# Altium schematic sheet Control.SchDoc
size 420 x 297 mm; DocumentNumber: Control, Wolf-2; SheetNumber: 6; SheetTotal: 6
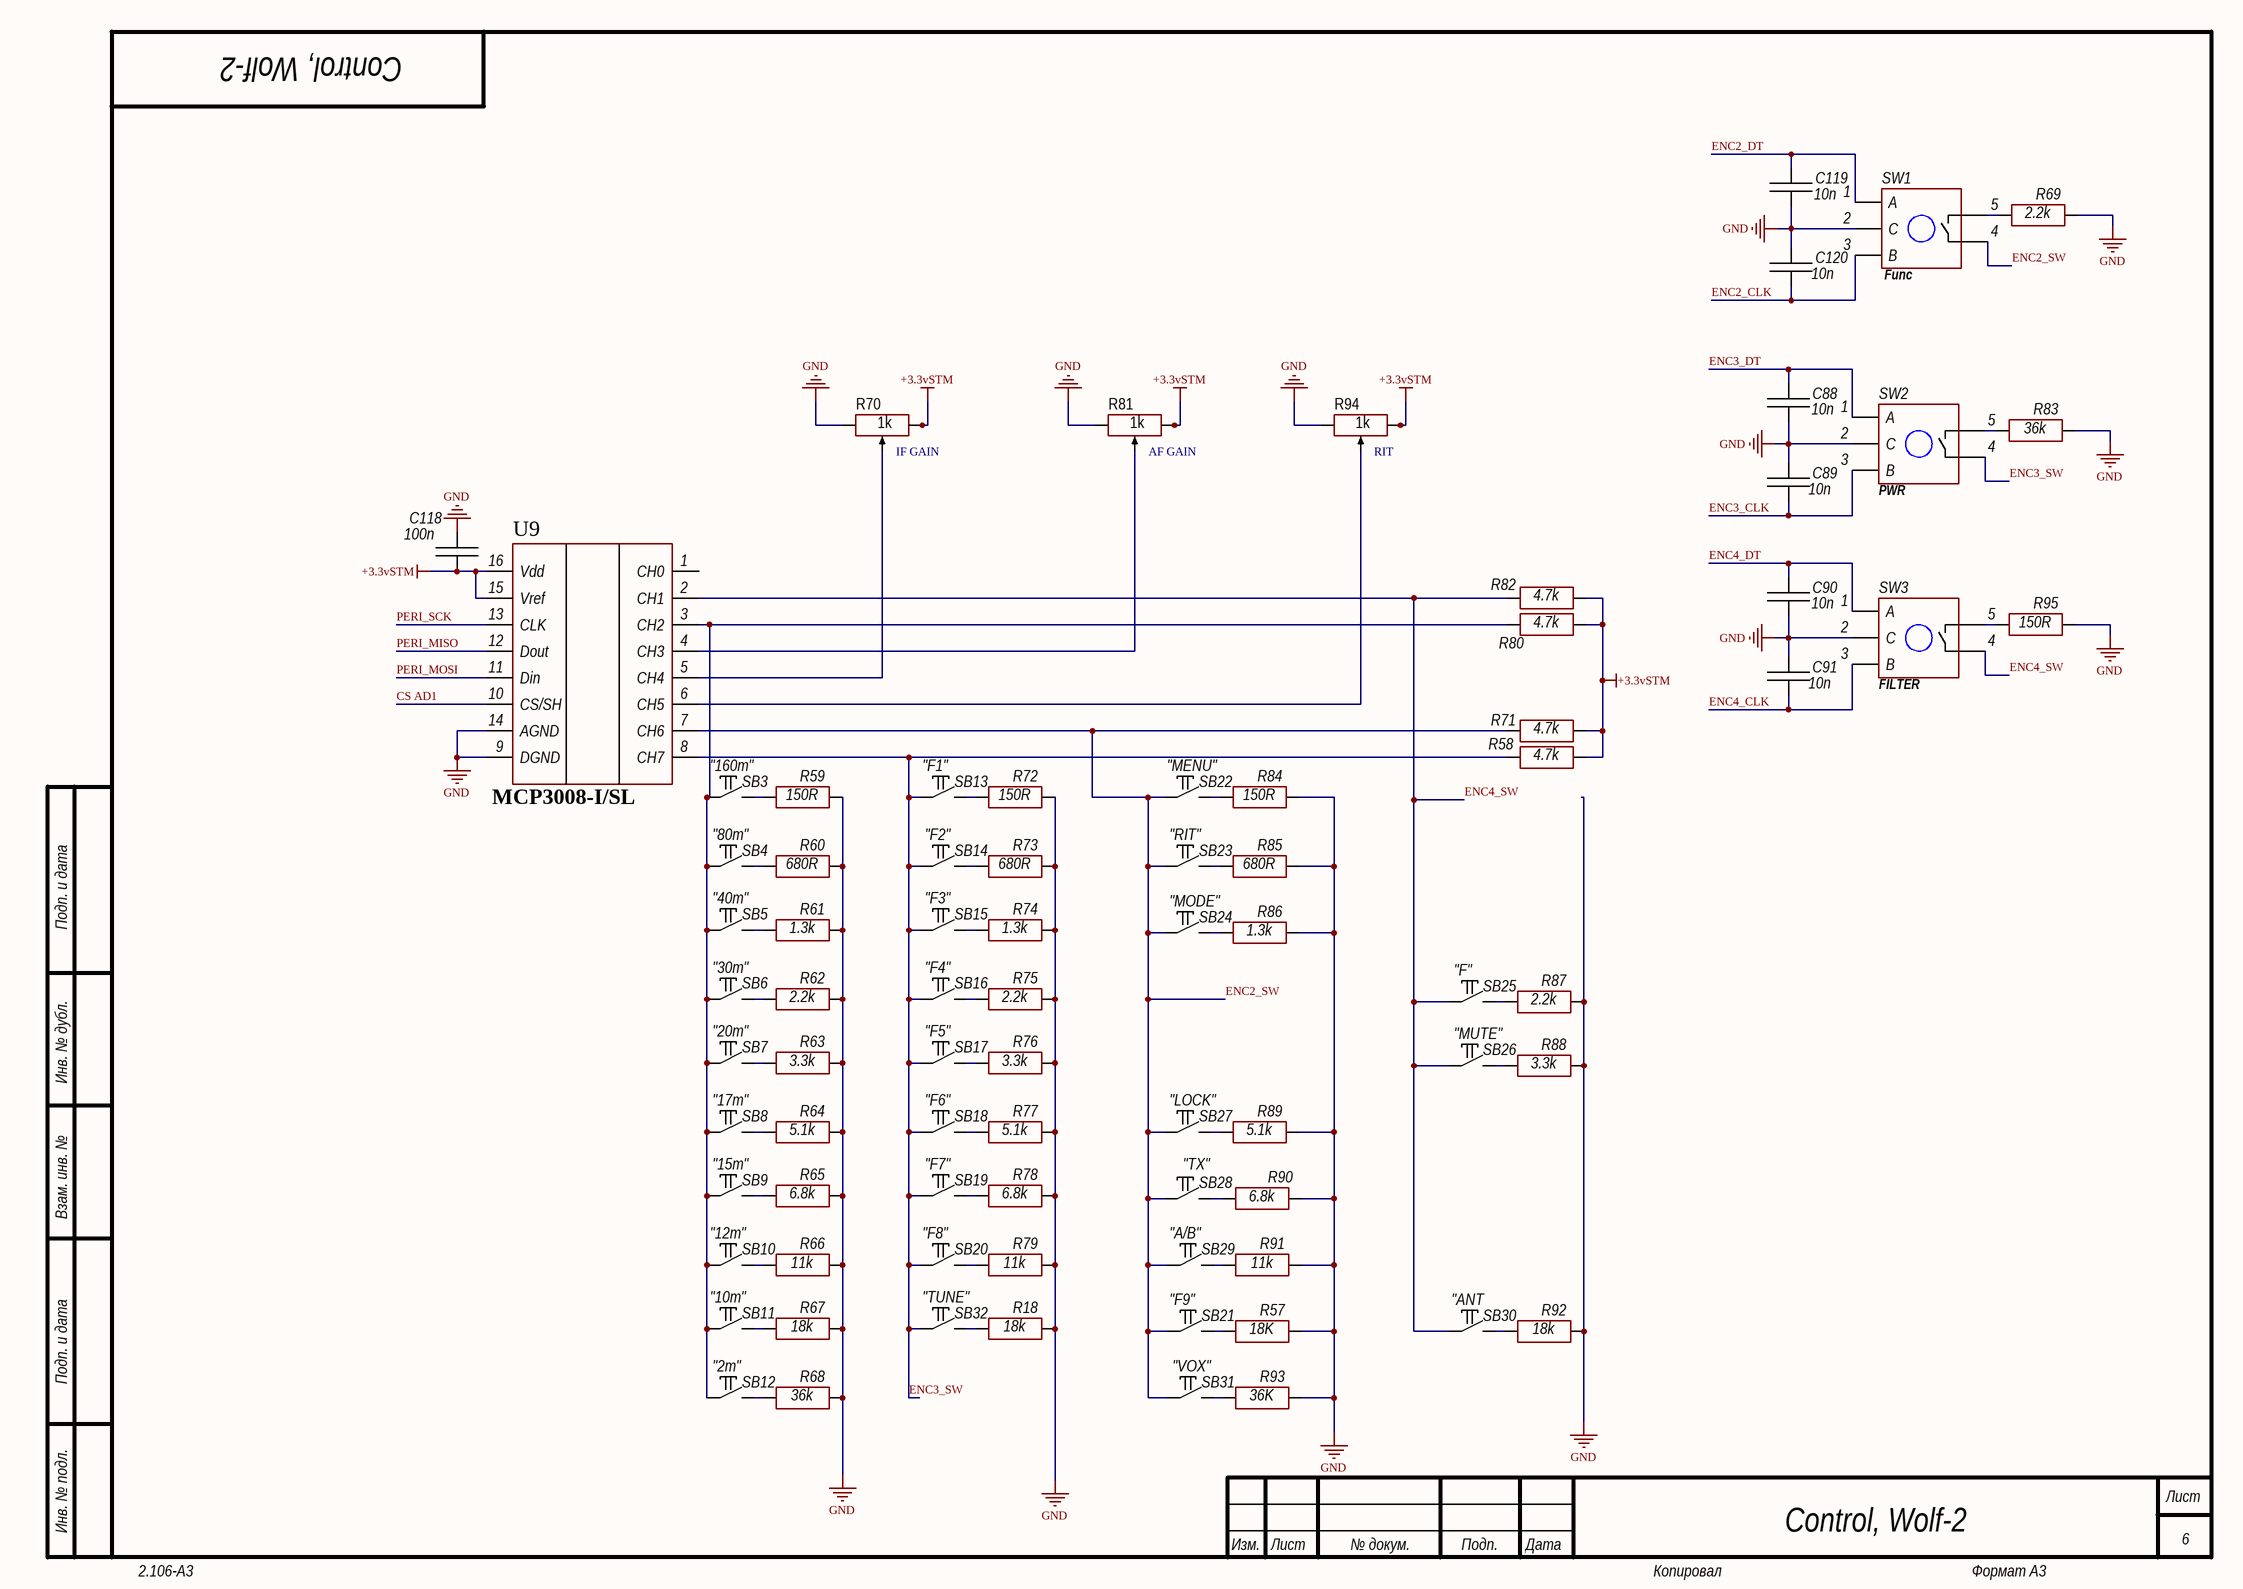
[diagram p0: Control.SchDoc]

## Parts
C88  10n  [CH0805C]
C89  10n  [CH0805C]
C90  10n  [CH0805C]
C91  10n  [CH0805C]
C118  100n  [CH0805C]
C119  10n  [CH0805C]
C120  10n  [CH0805C]
R18  18k  [CH0805R]
R57  18K  [CH0805R]
R58  4.7k  [CH0805R]
R59  150R  [CH0805R]
R60  680R  [CH0805R]
R61  1.3k  [CH0805R]
R62  2.2k  [CH0805R]
R63  3.3k  [CH0805R]
R64  5.1k  [CH0805R]
R65  6.8k  [CH0805R]
R66  11k  [CH0805R]
R67  18k  [CH0805R]
R68  36k  [CH0805R]
R69  2.2k  [CH0805R]
R70  1k  [PTV09]
R71  4.7k  [CH0805R]
R72  150R  [CH0805R]
R73  680R  [CH0805R]
R74  1.3k  [CH0805R]
R75  2.2k  [CH0805R]
R76  3.3k  [CH0805R]
R77  5.1k  [CH0805R]
R78  6.8k  [CH0805R]
R79  11k  [CH0805R]
R80  4.7k  [CH0805R]
R81  1k  [PTV09]
R82  4.7k  [CH0805R]
R83  36k  [CH0805R]
R84  150R  [CH0805R]
R85  680R  [CH0805R]
R86  1.3k  [CH0805R]
R87  2.2k  [CH0805R]
R88  3.3k  [CH0805R]
R89  5.1k  [CH0805R]
R90  6.8k  [CH0805R]
R91  11k  [CH0805R]
R92  18k  [CH0805R]
R93  36K  [CH0805R]
R94  1k  [PTV09]
R95  150R  [CH0805R]
SB3  "160m"  [BUT: 6x6]
SB4  "80m"  [BUT: 6x6]
SB5  "40m"  [BUT: 6x6]
SB6  "30m"  [BUT: 6x6]
SB7  "20m"  [BUT: 6x6]
SB8  "17m"  [BUT: 6x6]
SB9  "15m"  [BUT: 6x6]
SB10  "12m"  [BUT: 6x6]
SB11  "10m"  [BUT: 6x6]
SB12  "2m"  [BUT: 6x6]
SB13  "F1"  [BUT: 6x6]
SB14  "F2"  [BUT: 6x6]
SB15  "F3"  [BUT: 6x6]
SB16  "F4"  [BUT: 6x6]
SB17  "F5"  [BUT: 6x6]
SB18  "F6"  [BUT: 6x6]
SB19  "F7"  [BUT: 6x6]
SB20  "F8"  [BUT: 6x6]
SB21  "F9"  [BUT: 6x6]
SB22  "MENU"  [BUT: 6x6]
SB23  "RIT"  [BUT: 6x6]
SB24  "MODE"  [BUT: 6x6]
SB25  "F"  [BUT: 6x6]
SB26  "MUTE"  [BUT: 6x6]
SB27  "LOCK"  [BUT: 6x6]
SB28  "TX"  [BUT: 6x6]
SB29  "A/B"  [BUT: 6x6]
SB30  "ANT  [BUT: 6x6]
SB31  "VOX"  [BUT: 6x6]
SB32  "TUNE"  [BUT: 6x6]
SW1  Func  [ENC: PEC-12]
SW2  PWR  [ENC: PEC-12]
SW3  FILTER  [ENC: PEC-12]
U9  MCP3008-I/SL  [16-SOIC]

## Nets
+3.3vSTM: C118.1 R58.2 R70.1 R71.2 R80.2 R81.1 R82.2 R94.1 U9.15(Vref) U9.16(Vdd)
GND: C88.1 C89.2 C90.1 C91.2 C118.2 C119.1 C120.2 R18.2 R57.2 R59.2 R60.2 R61.2 R62.2 R63.2 R64.2 R65.2 R66.2 R67.2 R68.2 R69.2 R70.3 R72.2 R73.2 R74.2 R75.2 R76.2 R77.2 R78.2 R79.2 R81.3 R83.2 R84.2 R85.2 R86.2 R87.2 R88.2 R89.2 R90.2 R91.2 R92.2 R93.2 R94.3 R95.2 SW1.2(C) SW2.2(C) SW3.2(C) U9.9(DGND) U9.14(AGND)
CS AD1: U9.10(CS/SH)
ENC2_CLK: C120.1 SW1.3(B)
ENC2_DT: C119.2 SW1.1(A)
ENC2_SW: R71.1 SB21.1 SB22.1 SB23.1 SB24.1 SB27.1 SB28.1 SB29.1 SB31.1 SW1.4 U9.7(CH6)
ENC3_CLK: C89.1 SW2.3(B)
ENC3_DT: C88.2 SW2.1(A)
ENC3_SW: R58.1 SB13.1 SB14.1 SB15.1 SB16.1 SB17.1 SB18.1 SB19.1 SB20.1 SB32.1 SW2.4 U9.8(CH7)
ENC4_CLK: C91.1 SW3.3(B)
ENC4_DT: C90.2 SW3.1(A)
ENC4_SW: R82.1 SB25.1 SB26.1 SB30.1 SW3.4 U9.2(CH1)
PERI_MISO: U9.12(Dout)
PERI_MOSI: U9.11(Din)
PERI_SCK: U9.13(CLK)
NetR18_1: R18.1 SB32.2
NetR57_1: R57.1 SB21.2
NetR59_1: R59.1 SB3.2
NetR60_1: R60.1 SB4.2
NetR61_1: R61.1 SB5.2
NetR62_1: R62.1 SB6.2
NetR63_1: R63.1 SB7.2
NetR64_1: R64.1 SB8.2
NetR65_1: R65.1 SB9.2
NetR66_1: R66.1 SB10.2
NetR67_1: R67.1 SB11.2
NetR68_1: R68.1 SB12.2
NetR69_1: R69.1 SW1.5
NetR70_2: R70.2 U9.5(CH4)
NetR72_1: R72.1 SB13.2
NetR73_1: R73.1 SB14.2
NetR74_1: R74.1 SB15.2
NetR75_1: R75.1 SB16.2
NetR76_1: R76.1 SB17.2
NetR77_1: R77.1 SB18.2
NetR78_1: R78.1 SB19.2
NetR79_1: R79.1 SB20.2
NetR80_1: R80.1 SB3.1 SB4.1 SB5.1 SB6.1 SB7.1 SB8.1 SB9.1 SB10.1 SB11.1 SB12.1 U9.3(CH2)
NetR81_2: R81.2 U9.4(CH3)
NetR83_1: R83.1 SW2.5
NetR84_1: R84.1 SB22.2
NetR85_1: R85.1 SB23.2
NetR86_1: R86.1 SB24.2
NetR87_1: R87.1 SB25.2
NetR88_1: R88.1 SB26.2
NetR89_1: R89.1 SB27.2
NetR90_1: R90.1 SB28.2
NetR91_1: R91.1 SB29.2
NetR92_1: R92.1 SB30.2
NetR93_1: R93.1 SB31.2
NetR94_2: R94.2 U9.6(CH5)
NetR95_1: R95.1 SW3.5

Not connected (* = marked no-connect by the designer): U9 1(CH0)

## Notes on the sheet
- (near R70) IF GAIN
- (near R81) AF GAIN
- (near R94) RIT
- Подп. и дата
- Инв. № дубл.
- Взам. инв. №
- Инв. № подл.
- Изм.
- Лист
- № докум.
- Подп.
- Дата
- 2.106-A3
- Копировал
- Формат А3

## Library data of the parts
C88-C91 C118-C120 = Capacitor: Manufacturer: *; Model: *; HelpURL: *; ComponentKind: *; Value: *
R18 R57-R69 R71-R80 R82-R93 R95 = Resistor: Manufacturer: *; Model: *; HelpURL: *; ComponentKind: *; Value: *
R70 R81 R94 = Trimmer: Manufacturer: Bourns; PartNumber: 3296W-1-103LF; ValueManufacturerPartNumber: Resistor film, 1k, ±10%, 3296W, 0.5W, -55...+125°C; TypeResistor: Resistor film; Power: 0.5W; Tolerance: ±10%; Package: 3296W; HelpURL: https://www.digikey.com/product-detail/en/bourns-inc/3296W-1-103LF/3296W-103LF-ND/1088045; Temperature: -55...+125°C; Value: 1k
SB3-SB32 = Tactile switches: 6x6 mm; Manufacturer: *; Model: *; HelpURL: *; ComponentKind: *
SW1-SW3 = PEC12: Encoder; Model: *; Manufacturer: *; HelpURL: *; ComponentKind: *